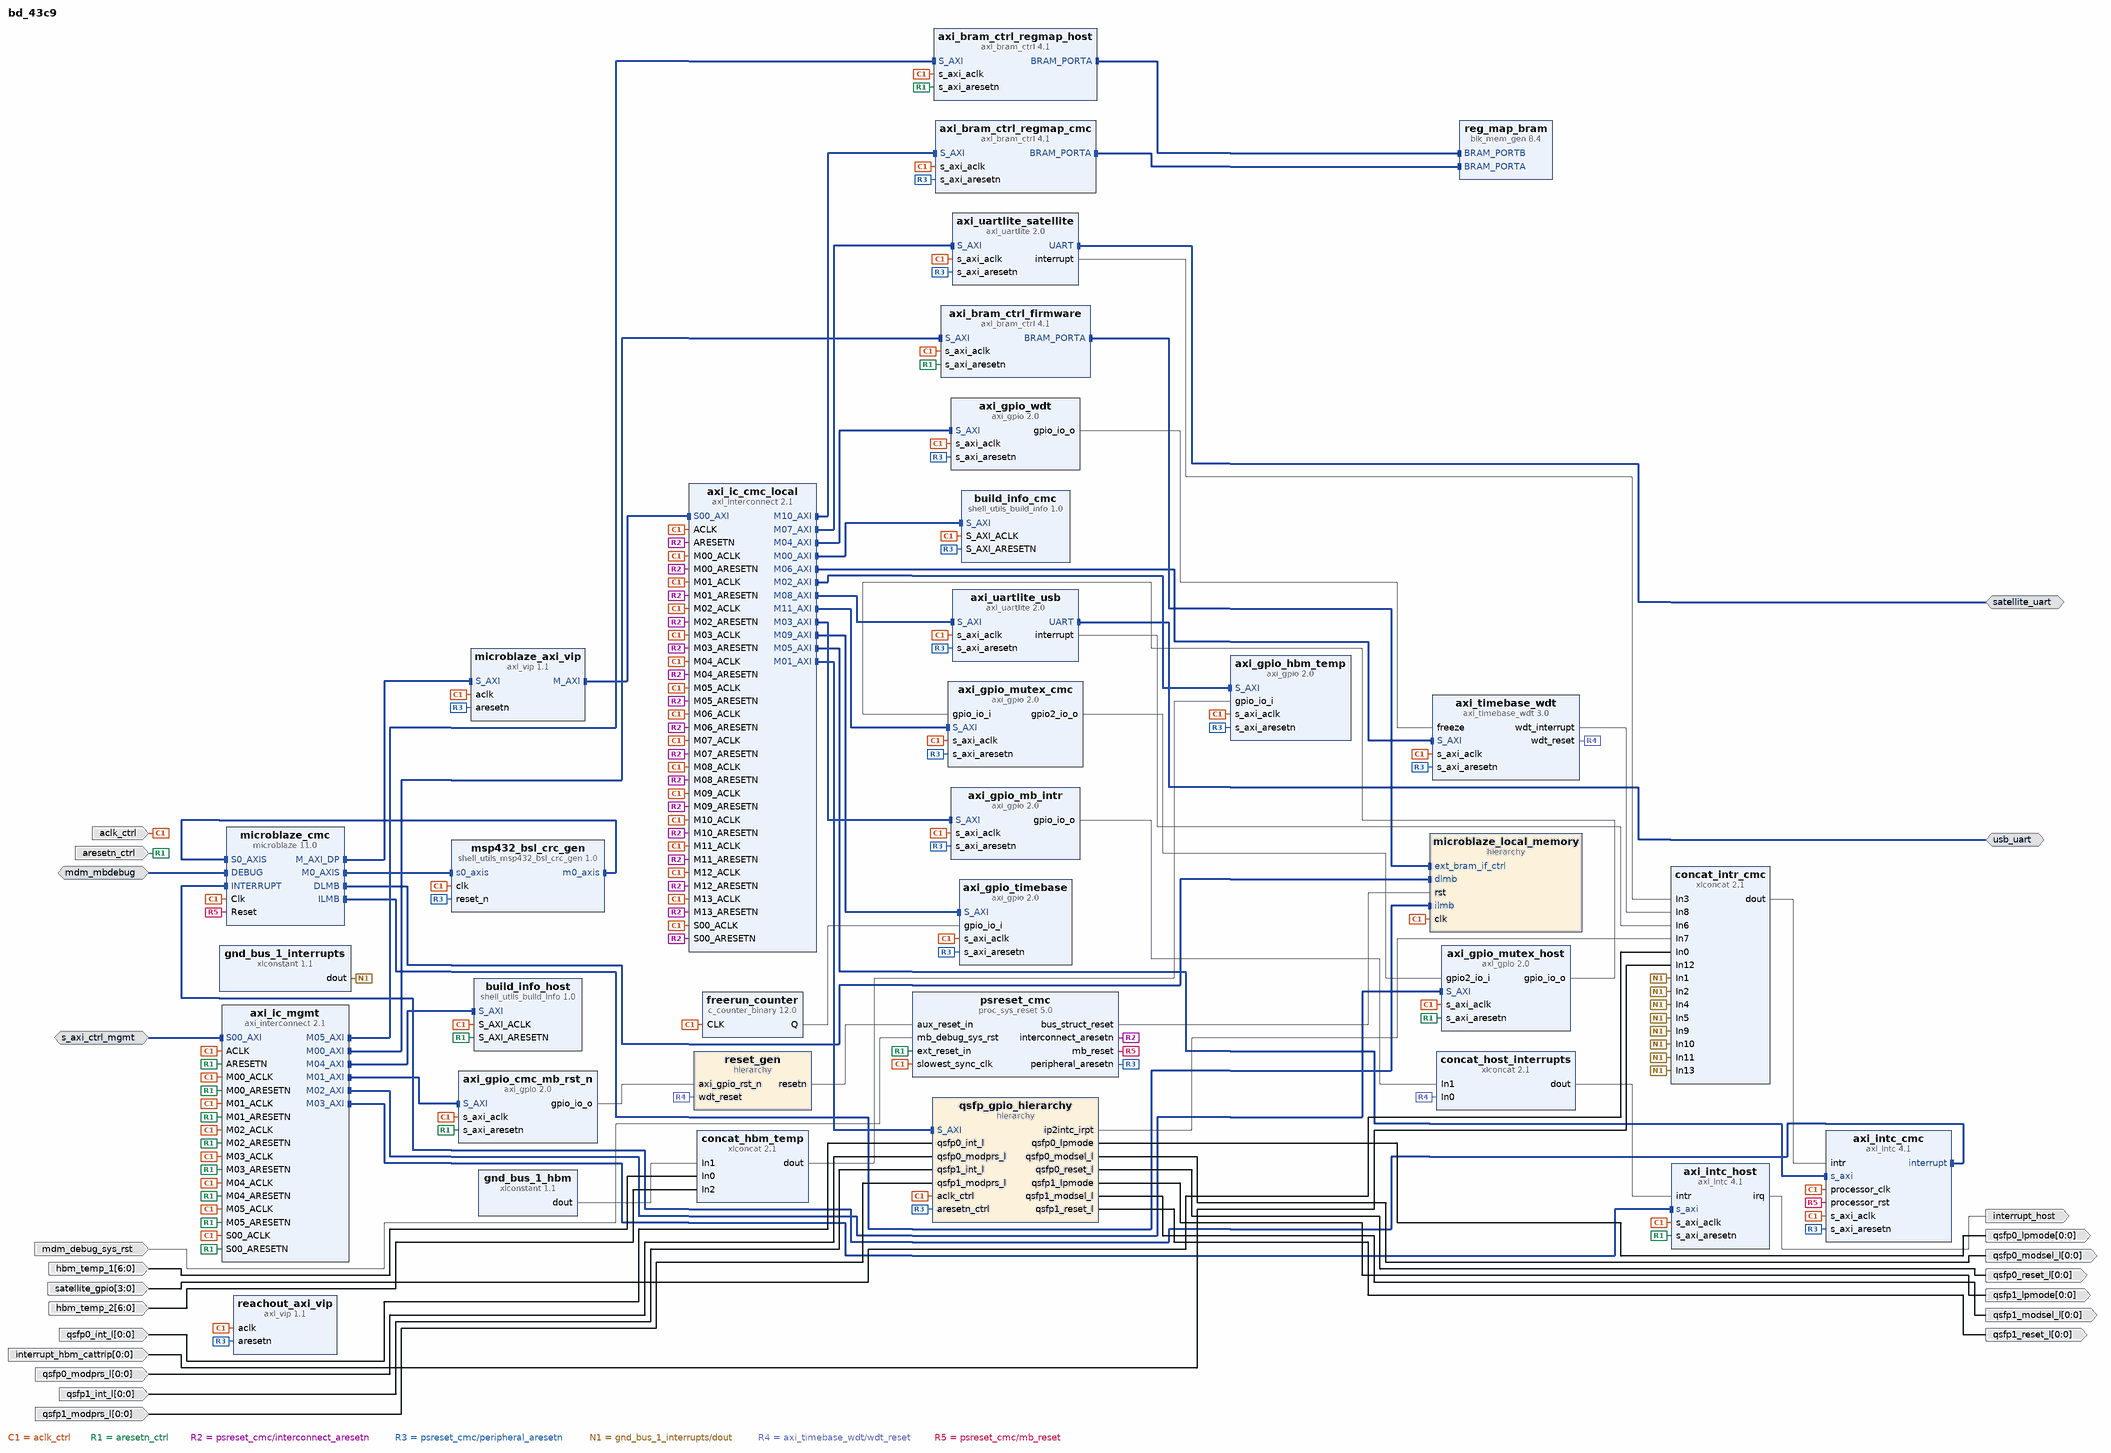
[diagram p0: block diagram of the top level]
# Vivado block design bd_43c9, xcu250-figd2104-2-e, Vivado 2020.2
create_bd_design bd_43c9

create_bd_intf_port -mode Slave -vlnv xilinx.com:interface:aximm_rtl:1.0 s_axi_ctrl_mgmt
set_property -dict [list \
  CONFIG.ADDR_WIDTH 18 \
  CONFIG.DATA_WIDTH 32 \
  CONFIG.HAS_BURST 0 \
  CONFIG.HAS_CACHE 0 \
  CONFIG.HAS_LOCK 0 \
  CONFIG.HAS_QOS 0 \
  CONFIG.INSERT_VIP 1 \
  CONFIG.MAX_BURST_LENGTH 1 \
  CONFIG.PROTOCOL AXI4LITE \
  CONFIG.SUPPORTS_NARROW_BURST 0 \
] [get_bd_intf_ports s_axi_ctrl_mgmt]
create_bd_intf_port -mode Slave -vlnv xilinx.com:interface:mbdebug_rtl:3.0 mdm_mbdebug
create_bd_intf_port -mode Master -vlnv xilinx.com:interface:uart_rtl:1.0 satellite_uart
create_bd_intf_port -mode Master -vlnv xilinx.com:interface:uart_rtl:1.0 usb_uart
create_bd_port -dir I -from 3 -to 0 -type intr satellite_gpio
set_property -dict {CONFIG.PortWidth 4 CONFIG.SENSITIVITY EDGE_RISING} [get_bd_ports satellite_gpio]
create_bd_port -dir I -type clk aclk_ctrl
set_property -dict [list \
  CONFIG.ASSOCIATED_BUSIF s_axi_ctrl_mgmt \
  CONFIG.ASSOCIATED_RESET aresetn_ctrl \
  CONFIG.INSERT_VIP 0 \
] [get_bd_ports aclk_ctrl]
create_bd_port -dir I -type rst aresetn_ctrl
set_property -dict {CONFIG.INSERT_VIP 0} [get_bd_ports aresetn_ctrl]
create_bd_port -dir I -type rst mdm_debug_sys_rst
set_property -dict {CONFIG.INSERT_VIP 0 CONFIG.POLARITY ACTIVE_HIGH} [get_bd_ports mdm_debug_sys_rst]
create_bd_port -dir I -from 0 -to 0 -type intr interrupt_hbm_cattrip
set_property -dict {CONFIG.PortWidth 1 CONFIG.SENSITIVITY LEVEL_HIGH} [get_bd_ports interrupt_hbm_cattrip]
create_bd_port -dir I -from 6 -to 0 hbm_temp_1
create_bd_port -dir I -from 6 -to 0 hbm_temp_2
create_bd_port -dir O -type intr interrupt_host
set_property -dict {CONFIG.SENSITIVITY LEVEL_HIGH} [get_bd_ports interrupt_host]
create_bd_port -dir I -from 0 -to 0 qsfp0_modprs_l
create_bd_port -dir I -from 0 -to 0 qsfp1_modprs_l
create_bd_port -dir I -from 0 -to 0 qsfp0_int_l
create_bd_port -dir I -from 0 -to 0 qsfp1_int_l
create_bd_port -dir O -from 0 -to 0 qsfp0_lpmode
create_bd_port -dir O -from 0 -to 0 qsfp1_lpmode
create_bd_port -dir O -from 0 -to 0 qsfp0_modsel_l
create_bd_port -dir O -from 0 -to 0 qsfp1_modsel_l
create_bd_port -dir O -from 0 -to 0 qsfp0_reset_l
create_bd_port -dir O -from 0 -to 0 qsfp1_reset_l

create_bd_cell -type ip -vlnv xilinx.com:ip:shell_utils_build_info:1.0 build_info_cmc
set_property -dict [list \
  CONFIG.C_CORE_REVISION 0 \
  CONFIG.C_MAJOR_VERSION 2 \
  CONFIG.C_MINOR_VERSION 2 \
  CONFIG.C_PATCH_REVISION 0 \
  CONFIG.C_PERFORCE_CL 3064653 \
  CONFIG.C_RESERVED_TAG 0x00000000 \
  CONFIG.C_SUBSYSTEM_ID 0x02 \
  CONFIG.C_VIV_VERSION 0x202010 \
] [get_bd_cells build_info_cmc]
create_bd_cell -type ip -vlnv xilinx.com:ip:shell_utils_build_info:1.0 build_info_host
set_property -dict [list \
  CONFIG.C_CORE_REVISION 0 \
  CONFIG.C_MAJOR_VERSION 2 \
  CONFIG.C_MINOR_VERSION 2 \
  CONFIG.C_PATCH_REVISION 0 \
  CONFIG.C_PERFORCE_CL 3064653 \
  CONFIG.C_RESERVED_TAG 0x00000000 \
  CONFIG.C_SUBSYSTEM_ID 0x02 \
  CONFIG.C_VIV_VERSION 0x202010 \
] [get_bd_cells build_info_host]
create_bd_cell -type ip -vlnv xilinx.com:ip:axi_gpio:2.0 axi_gpio_timebase
set_property -dict {CONFIG.C_ALL_INPUTS 1 CONFIG.C_GPIO_WIDTH 32} [get_bd_cells axi_gpio_timebase]
create_bd_cell -type ip -vlnv xilinx.com:ip:axi_gpio:2.0 axi_gpio_cmc_mb_rst_n
set_property -dict [list \
  CONFIG.C_ALL_OUTPUTS 1 \
  CONFIG.C_DOUT_DEFAULT 0x00000000 \
  CONFIG.C_GPIO_WIDTH 1 \
] [get_bd_cells axi_gpio_cmc_mb_rst_n]
create_bd_cell -type ip -vlnv xilinx.com:ip:axi_gpio:2.0 axi_gpio_hbm_temp
set_property -dict {CONFIG.C_ALL_INPUTS 1 CONFIG.C_GPIO_WIDTH 15} [get_bd_cells axi_gpio_hbm_temp]
create_bd_cell -type ip -vlnv xilinx.com:ip:axi_gpio:2.0 axi_gpio_wdt
set_property -dict {CONFIG.C_ALL_OUTPUTS 1 CONFIG.C_GPIO_WIDTH 1} [get_bd_cells axi_gpio_wdt]
create_bd_cell -type ip -vlnv xilinx.com:ip:axi_gpio:2.0 axi_gpio_mb_intr
set_property -dict {CONFIG.C_ALL_OUTPUTS 1 CONFIG.C_GPIO_WIDTH 31} [get_bd_cells axi_gpio_mb_intr]
create_bd_cell -type ip -vlnv xilinx.com:ip:axi_gpio:2.0 axi_gpio_mutex_cmc
set_property -dict [list \
  CONFIG.C_ALL_INPUTS 1 \
  CONFIG.C_ALL_INPUTS_2 0 \
  CONFIG.C_ALL_OUTPUTS_2 1 \
  CONFIG.C_GPIO2_WIDTH 2 \
  CONFIG.C_GPIO_WIDTH 1 \
  CONFIG.C_IS_DUAL 1 \
] [get_bd_cells axi_gpio_mutex_cmc]
create_bd_cell -type ip -vlnv xilinx.com:ip:axi_gpio:2.0 axi_gpio_mutex_host
set_property -dict [list \
  CONFIG.C_ALL_INPUTS_2 1 \
  CONFIG.C_ALL_OUTPUTS 1 \
  CONFIG.C_DOUT_DEFAULT 0x00000000 \
  CONFIG.C_GPIO2_WIDTH 2 \
  CONFIG.C_GPIO_WIDTH 1 \
  CONFIG.C_IS_DUAL 1 \
] [get_bd_cells axi_gpio_mutex_host]
create_bd_cell -type ip -vlnv xilinx.com:ip:axi_intc:4.1 axi_intc_cmc
set_property -dict [list \
  CONFIG.C_ASYNC_INTR 0x0000800F \
  CONFIG.C_ENABLE_ASYNC 0 \
  CONFIG.C_HAS_FAST 1 \
  CONFIG.C_KIND_OF_EDGE 0xFFFFFFFF \
  CONFIG.C_KIND_OF_INTR 0x0000024F \
  CONFIG.C_KIND_OF_LVL 0xFFFFFFFF \
  CONFIG.C_NUM_SW_INTR 15 \
] [get_bd_cells axi_intc_cmc]
create_bd_cell -type ip -vlnv xilinx.com:ip:axi_intc:4.1 axi_intc_host
set_property -dict [list \
  CONFIG.C_ASYNC_INTR 0x00000000 \
  CONFIG.C_ENABLE_ASYNC 0 \
  CONFIG.C_IRQ_CONNECTION 1 \
  CONFIG.C_KIND_OF_EDGE 0xFFFFFFFF \
  CONFIG.C_KIND_OF_INTR 0xFFFFFFFF \
  CONFIG.C_KIND_OF_LVL 0xFFFFFFFF \
  CONFIG.C_NUM_SW_INTR 0 \
] [get_bd_cells axi_intc_host]
create_bd_cell -type ip -vlnv xilinx.com:ip:axi_timebase_wdt:3.0 axi_timebase_wdt
set_property -dict {CONFIG.C_WDT_INTERVAL 31 CONFIG.WDT_ENABLE_ONCE Enable_repeatedly} [get_bd_cells axi_timebase_wdt]
create_bd_cell -type ip -vlnv xilinx.com:ip:axi_uartlite:2.0 axi_uartlite_satellite
set_property -dict {CONFIG.C_BAUDRATE 115200 CONFIG.C_USE_PARITY 1 CONFIG.PARITY Even} [get_bd_cells axi_uartlite_satellite]
create_bd_cell -type ip -vlnv xilinx.com:ip:axi_uartlite:2.0 axi_uartlite_usb
set_property -dict {CONFIG.C_BAUDRATE 115200} [get_bd_cells axi_uartlite_usb]
create_bd_cell -type ip -vlnv xilinx.com:ip:axi_interconnect:2.1 axi_ic_cmc_local
set_property -dict [list \
  CONFIG.M00_HAS_REGSLICE 0 \
  CONFIG.M01_HAS_REGSLICE 0 \
  CONFIG.M02_HAS_REGSLICE 0 \
  CONFIG.M03_HAS_REGSLICE 0 \
  CONFIG.M04_HAS_REGSLICE 0 \
  CONFIG.M05_HAS_REGSLICE 0 \
  CONFIG.M06_HAS_REGSLICE 0 \
  CONFIG.M07_HAS_REGSLICE 0 \
  CONFIG.M08_HAS_REGSLICE 0 \
  CONFIG.M09_HAS_REGSLICE 0 \
  CONFIG.M10_HAS_REGSLICE 0 \
  CONFIG.M11_HAS_REGSLICE 0 \
  CONFIG.M12_HAS_REGSLICE 0 \
  CONFIG.M13_HAS_REGSLICE 0 \
  CONFIG.NUM_MI 14 \
  CONFIG.S00_HAS_REGSLICE 0 \
] [get_bd_cells axi_ic_cmc_local]
create_bd_cell -type ip -vlnv xilinx.com:ip:axi_interconnect:2.1 axi_ic_mgmt
set_property -dict {CONFIG.NUM_MI 6} [get_bd_cells axi_ic_mgmt]
create_bd_cell -type ip -vlnv xilinx.com:ip:axi_bram_ctrl:4.1 axi_bram_ctrl_firmware
set_property -dict {CONFIG.PROTOCOL AXI4LITE CONFIG.SINGLE_PORT_BRAM 1} [get_bd_cells axi_bram_ctrl_firmware]
create_bd_cell -type hier microblaze_local_memory
create_bd_cell -type ip -vlnv xilinx.com:ip:microblaze:11.0 microblaze_cmc
set_property -dict [list \
  CONFIG.C_ASYNC_WAKEUP 3 \
  CONFIG.C_BASE_VECTORS 0x00000000F0000000 \
  CONFIG.C_D_AXI 1 \
  CONFIG.C_ENABLE_DISCRETE_PORTS 0 \
  CONFIG.C_FSL_LINKS 1 \
  CONFIG.C_M_AXI_DC_USER_SIGNALS 0 \
  CONFIG.C_M_AXI_IC_USER_SIGNALS 0 \
  CONFIG.C_USE_BARREL 1 \
  CONFIG.C_USE_DIV 1 \
  CONFIG.C_USE_EXT_BRK 0 \
  CONFIG.C_USE_EXT_NM_BRK 0 \
  CONFIG.C_USE_HW_MUL 2 \
  CONFIG.C_USE_INTERRUPT 2 \
  CONFIG.C_USE_MSR_INSTR 1 \
  CONFIG.C_USE_NON_SECURE 0 \
  CONFIG.C_USE_PCMP_INSTR 1 \
] [get_bd_cells microblaze_cmc]
create_bd_cell -type ip -vlnv xilinx.com:ip:axi_vip:1.1 microblaze_axi_vip
create_bd_cell -type ip -vlnv xilinx.com:ip:axi_vip:1.1 reachout_axi_vip
create_bd_cell -type ip -vlnv xilinx.com:ip:shell_utils_msp432_bsl_crc_gen:1.0 msp432_bsl_crc_gen
create_bd_cell -type ip -vlnv xilinx.com:ip:proc_sys_reset:5.0 psreset_cmc
set_property -dict {CONFIG.C_AUX_RST_WIDTH 1 CONFIG.C_EXT_RST_WIDTH 1} [get_bd_cells psreset_cmc]
create_bd_cell -type ip -vlnv xilinx.com:ip:blk_mem_gen:8.4 reg_map_bram
set_property -dict [list \
  CONFIG.Assume_Synchronous_Clk true \
  CONFIG.Enable_B Use_ENB_Pin \
  CONFIG.Memory_Type True_Dual_Port_RAM \
  CONFIG.Use_RSTB_Pin true \
] [get_bd_cells reg_map_bram]
create_bd_cell -type ip -vlnv xilinx.com:ip:axi_bram_ctrl:4.1 axi_bram_ctrl_regmap_cmc
set_property -dict {CONFIG.PROTOCOL AXI4LITE CONFIG.SINGLE_PORT_BRAM 1} [get_bd_cells axi_bram_ctrl_regmap_cmc]
create_bd_cell -type ip -vlnv xilinx.com:ip:axi_bram_ctrl:4.1 axi_bram_ctrl_regmap_host
set_property -dict {CONFIG.PROTOCOL AXI4LITE CONFIG.SINGLE_PORT_BRAM 1} [get_bd_cells axi_bram_ctrl_regmap_host]
create_bd_cell -type ip -vlnv xilinx.com:ip:xlconcat:2.1 concat_intr_cmc
set_property -dict {CONFIG.IN0_WIDTH 4 CONFIG.NUM_PORTS 14} [get_bd_cells concat_intr_cmc]
create_bd_cell -type ip -vlnv xilinx.com:ip:xlconcat:2.1 concat_hbm_temp
set_property -dict {CONFIG.IN0_WIDTH 7 CONFIG.IN2_WIDTH 7 CONFIG.NUM_PORTS 3} [get_bd_cells concat_hbm_temp]
create_bd_cell -type ip -vlnv xilinx.com:ip:xlconcat:2.1 concat_host_interrupts
set_property -dict {CONFIG.IN1_WIDTH 31 CONFIG.NUM_PORTS 2} [get_bd_cells concat_host_interrupts]
create_bd_cell -type ip -vlnv xilinx.com:ip:xlconstant:1.1 gnd_bus_1_hbm
set_property -dict {CONFIG.CONST_VAL 0 CONFIG.CONST_WIDTH 1} [get_bd_cells gnd_bus_1_hbm]
create_bd_cell -type ip -vlnv xilinx.com:ip:xlconstant:1.1 gnd_bus_1_interrupts
set_property -dict {CONFIG.CONST_VAL 0 CONFIG.CONST_WIDTH 1} [get_bd_cells gnd_bus_1_interrupts]
create_bd_cell -type ip -vlnv xilinx.com:ip:c_counter_binary:12.0 freerun_counter
set_property -dict {CONFIG.Output_Width 32} [get_bd_cells freerun_counter]
create_bd_cell -type hier qsfp_gpio_hierarchy
create_bd_cell -type hier reset_gen

# ---- hierarchy /microblaze_local_memory ----
current_bd_instance /microblaze_local_memory
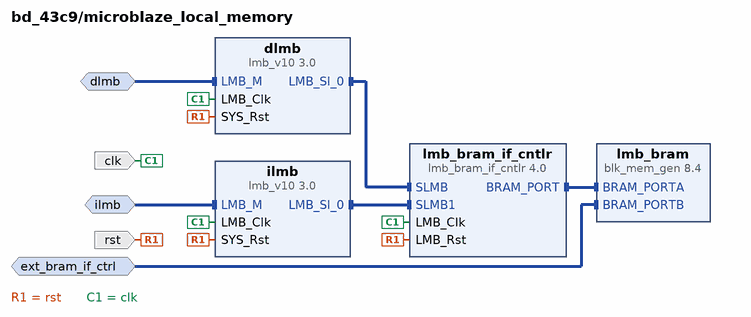
[diagram p1: block diagram inside /microblaze_local_memory]
create_bd_intf_pin -mode MirroredMaster -vlnv xilinx.com:interface:lmb_rtl:1.0 dlmb
create_bd_intf_pin -mode MirroredMaster -vlnv xilinx.com:interface:lmb_rtl:1.0 ilmb
create_bd_intf_pin -mode Slave -vlnv xilinx.com:interface:bram_rtl:1.0 ext_bram_if_ctrl
create_bd_pin -dir I -type clk clk
create_bd_pin -dir I -type rst rst

create_bd_cell -type ip -vlnv xilinx.com:ip:lmb_v10:3.0 dlmb
create_bd_cell -type ip -vlnv xilinx.com:ip:lmb_v10:3.0 ilmb
create_bd_cell -type ip -vlnv xilinx.com:ip:blk_mem_gen:8.4 lmb_bram
set_property -dict {CONFIG.Memory_Type True_Dual_Port_RAM CONFIG.PRIM_type_to_Implement BRAM} [get_bd_cells lmb_bram]
create_bd_cell -type ip -vlnv xilinx.com:ip:lmb_bram_if_cntlr:4.0 lmb_bram_if_cntlr
set_property -dict {CONFIG.C_NUM_LMB 2} [get_bd_cells lmb_bram_if_cntlr]

# ---- hierarchy /qsfp_gpio_hierarchy ----
current_bd_instance /qsfp_gpio_hierarchy
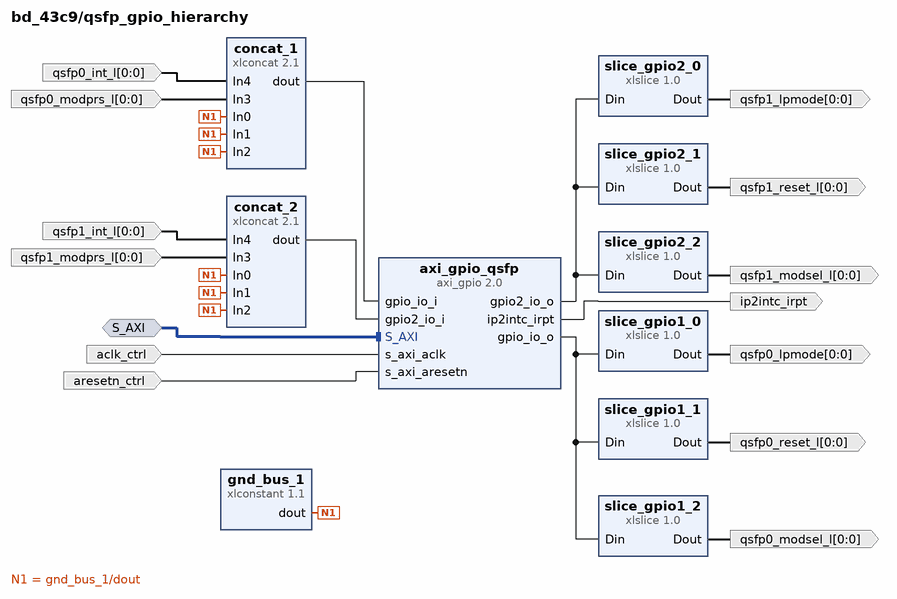
[diagram p2: block diagram inside /qsfp_gpio_hierarchy]
create_bd_intf_pin -mode Slave -vlnv xilinx.com:interface:aximm_rtl:1.0 S_AXI
create_bd_pin -dir I -type clk aclk_ctrl
create_bd_pin -dir O -type intr ip2intc_irpt
create_bd_pin -dir I -from 0 -to 0 qsfp0_int_l
create_bd_pin -dir O -from 0 -to 0 qsfp0_lpmode
create_bd_pin -dir I -from 0 -to 0 qsfp0_modprs_l
create_bd_pin -dir O -from 0 -to 0 qsfp0_modsel_l
create_bd_pin -dir O -from 0 -to 0 qsfp0_reset_l
create_bd_pin -dir I -from 0 -to 0 qsfp1_int_l
create_bd_pin -dir O -from 0 -to 0 qsfp1_lpmode
create_bd_pin -dir I -from 0 -to 0 qsfp1_modprs_l
create_bd_pin -dir O -from 0 -to 0 qsfp1_modsel_l
create_bd_pin -dir O -from 0 -to 0 qsfp1_reset_l
create_bd_pin -dir I -type rst aresetn_ctrl

create_bd_cell -type ip -vlnv xilinx.com:ip:axi_gpio:2.0 axi_gpio_qsfp
set_property -dict [list \
  CONFIG.C_ALL_OUTPUTS_2 0 \
  CONFIG.C_DOUT_DEFAULT 0x00000002 \
  CONFIG.C_DOUT_DEFAULT_2 0x00000002 \
  CONFIG.C_GPIO2_WIDTH 5 \
  CONFIG.C_GPIO_WIDTH 5 \
  CONFIG.C_INTERRUPT_PRESENT 1 \
  CONFIG.C_IS_DUAL 1 \
  CONFIG.C_TRI_DEFAULT 0xFFFFFFF8 \
  CONFIG.C_TRI_DEFAULT_2 0xFFFFFFF8 \
] [get_bd_cells axi_gpio_qsfp]
create_bd_cell -type ip -vlnv xilinx.com:ip:xlconcat:2.1 concat_1
set_property -dict {CONFIG.NUM_PORTS 5} [get_bd_cells concat_1]
create_bd_cell -type ip -vlnv xilinx.com:ip:xlconcat:2.1 concat_2
set_property -dict {CONFIG.NUM_PORTS 5} [get_bd_cells concat_2]
create_bd_cell -type ip -vlnv xilinx.com:ip:xlconstant:1.1 gnd_bus_1
set_property -dict {CONFIG.CONST_VAL 0} [get_bd_cells gnd_bus_1]
create_bd_cell -type ip -vlnv xilinx.com:ip:xlslice:1.0 slice_gpio1_0
set_property -dict {CONFIG.DIN_FROM 0 CONFIG.DIN_TO 0 CONFIG.DIN_WIDTH 5} [get_bd_cells slice_gpio1_0]
create_bd_cell -type ip -vlnv xilinx.com:ip:xlslice:1.0 slice_gpio1_1
set_property -dict {CONFIG.DIN_FROM 1 CONFIG.DIN_TO 1 CONFIG.DIN_WIDTH 5 CONFIG.DOUT_WIDTH 1} [get_bd_cells slice_gpio1_1]
create_bd_cell -type ip -vlnv xilinx.com:ip:xlslice:1.0 slice_gpio1_2
set_property -dict {CONFIG.DIN_FROM 2 CONFIG.DIN_TO 2 CONFIG.DIN_WIDTH 5 CONFIG.DOUT_WIDTH 1} [get_bd_cells slice_gpio1_2]
create_bd_cell -type ip -vlnv xilinx.com:ip:xlslice:1.0 slice_gpio2_0
set_property -dict {CONFIG.DIN_FROM 0 CONFIG.DIN_TO 0 CONFIG.DIN_WIDTH 5} [get_bd_cells slice_gpio2_0]
create_bd_cell -type ip -vlnv xilinx.com:ip:xlslice:1.0 slice_gpio2_1
set_property -dict {CONFIG.DIN_FROM 1 CONFIG.DIN_TO 1 CONFIG.DIN_WIDTH 5 CONFIG.DOUT_WIDTH 1} [get_bd_cells slice_gpio2_1]
create_bd_cell -type ip -vlnv xilinx.com:ip:xlslice:1.0 slice_gpio2_2
set_property -dict {CONFIG.DIN_FROM 2 CONFIG.DIN_TO 2 CONFIG.DIN_WIDTH 5 CONFIG.DOUT_WIDTH 1} [get_bd_cells slice_gpio2_2]

# ---- hierarchy /reset_gen ----
current_bd_instance /reset_gen
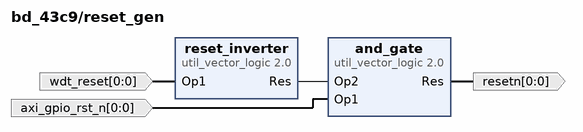
[diagram p3: block diagram inside /reset_gen]
create_bd_pin -dir I -from 0 -to 0 axi_gpio_rst_n
create_bd_pin -dir I -from 0 -to 0 wdt_reset
create_bd_pin -dir O -from 0 -to 0 resetn

create_bd_cell -type ip -vlnv xilinx.com:ip:util_vector_logic:2.0 and_gate
set_property -dict {CONFIG.C_OPERATION and CONFIG.C_SIZE 1} [get_bd_cells and_gate]
create_bd_cell -type ip -vlnv xilinx.com:ip:util_vector_logic:2.0 reset_inverter
set_property -dict {CONFIG.C_OPERATION not CONFIG.C_SIZE 1} [get_bd_cells reset_inverter]

# ---- connections ----

current_bd_instance /microblaze_local_memory
connect_bd_intf_net [get_bd_intf_pins dlmb] [get_bd_intf_pins dlmb/LMB_M]
connect_bd_intf_net [get_bd_intf_pins ilmb] [get_bd_intf_pins ilmb/LMB_M]
connect_bd_intf_net -intf_net dlmb_s [get_bd_intf_pins dlmb/LMB_Sl_0] [get_bd_intf_pins lmb_bram_if_cntlr/SLMB]
connect_bd_intf_net -intf_net ilmb_s [get_bd_intf_pins ilmb/LMB_Sl_0] [get_bd_intf_pins lmb_bram_if_cntlr/SLMB1]
connect_bd_intf_net -intf_net lmb_bram_if_ctrl [get_bd_intf_pins lmb_bram/BRAM_PORTA] [get_bd_intf_pins lmb_bram_if_cntlr/BRAM_PORT]
connect_bd_intf_net [get_bd_intf_pins ext_bram_if_ctrl] [get_bd_intf_pins lmb_bram/BRAM_PORTB]
connect_bd_net [get_bd_pins rst] [get_bd_pins dlmb/SYS_Rst] [get_bd_pins ilmb/SYS_Rst] [get_bd_pins lmb_bram_if_cntlr/LMB_Rst]
connect_bd_net [get_bd_pins clk] [get_bd_pins dlmb/LMB_Clk] [get_bd_pins ilmb/LMB_Clk] [get_bd_pins lmb_bram_if_cntlr/LMB_Clk]
set_property HDL_ATTRIBUTE.BMM_INFO_ADDRESS_SPACE {byte  0xF0000000 32 > bd_43c9 microblaze_local_memory/lmb_bram} [get_bd_cells lmb_bram_if_cntlr]
set_property HDL_ATTRIBUTE.KEEP_HIERARCHY yes [get_bd_cells lmb_bram_if_cntlr]

current_bd_instance /qsfp_gpio_hierarchy
connect_bd_intf_net -intf_net axi_int_cmc_2_M03 [get_bd_intf_pins S_AXI] [get_bd_intf_pins axi_gpio_qsfp/S_AXI]
connect_bd_net -net axi_gpio_qsfp_in_1 [get_bd_pins concat_1/dout] [get_bd_pins axi_gpio_qsfp/gpio_io_i]
connect_bd_net -net axi_gpio_qsfp_in_2 [get_bd_pins concat_2/dout] [get_bd_pins axi_gpio_qsfp/gpio2_io_i]
connect_bd_net -net axi_gpio_qsfp_out_1 [get_bd_pins axi_gpio_qsfp/gpio_io_o] \
  [get_bd_pins slice_gpio1_0/Din] [get_bd_pins slice_gpio1_1/Din] [get_bd_pins slice_gpio1_2/Din]
connect_bd_net -net axi_gpio_qsfp_out_2 [get_bd_pins axi_gpio_qsfp/gpio2_io_o] \
  [get_bd_pins slice_gpio2_0/Din] [get_bd_pins slice_gpio2_1/Din] [get_bd_pins slice_gpio2_2/Din]
connect_bd_net [get_bd_pins aclk_ctrl] [get_bd_pins axi_gpio_qsfp/s_axi_aclk]
connect_bd_net -net cmc_perip_aresetn [get_bd_pins aresetn_ctrl] [get_bd_pins axi_gpio_qsfp/s_axi_aresetn]
connect_bd_net -net intr_gpio_qsfp [get_bd_pins axi_gpio_qsfp/ip2intc_irpt] [get_bd_pins ip2intc_irpt]
connect_bd_net [get_bd_pins qsfp0_int_l] [get_bd_pins concat_1/In4]
connect_bd_net -net qsfp0_lpmode [get_bd_pins slice_gpio1_0/Dout] [get_bd_pins qsfp0_lpmode]
connect_bd_net [get_bd_pins qsfp0_modprs_l] [get_bd_pins concat_1/In3]
connect_bd_net -net qsfp0_modsel_l [get_bd_pins slice_gpio1_2/Dout] [get_bd_pins qsfp0_modsel_l]
connect_bd_net -net qsfp0_reset_l [get_bd_pins slice_gpio1_1/Dout] [get_bd_pins qsfp0_reset_l]
connect_bd_net [get_bd_pins qsfp1_int_l] [get_bd_pins concat_2/In4]
connect_bd_net -net qsfp1_lpmode [get_bd_pins slice_gpio2_0/Dout] [get_bd_pins qsfp1_lpmode]
connect_bd_net [get_bd_pins qsfp1_modprs_l] [get_bd_pins concat_2/In3]
connect_bd_net -net qsfp1_modsel_l [get_bd_pins slice_gpio2_2/Dout] [get_bd_pins qsfp1_modsel_l]
connect_bd_net -net qsfp1_reset_l [get_bd_pins slice_gpio2_1/Dout] [get_bd_pins qsfp1_reset_l]
connect_bd_net -net gnd_bus_1 [get_bd_pins gnd_bus_1/dout] \
  [get_bd_pins concat_1/In0] [get_bd_pins concat_1/In1] [get_bd_pins concat_1/In2] [get_bd_pins concat_2/In0] \
  [get_bd_pins concat_2/In1] [get_bd_pins concat_2/In2]

current_bd_instance /reset_gen
connect_bd_net -net wdt_reset_net [get_bd_pins wdt_reset] [get_bd_pins reset_inverter/Op1]
connect_bd_net -net axi_gpio_rst_n_net [get_bd_pins axi_gpio_rst_n] [get_bd_pins and_gate/Op1]
connect_bd_net -net reset_inverter_net [get_bd_pins reset_inverter/Res] [get_bd_pins and_gate/Op2]
connect_bd_net -net resetn_net [get_bd_pins and_gate/Res] [get_bd_pins resetn]

current_bd_instance /
connect_bd_intf_net [get_bd_intf_pins build_info_host/S_AXI] [get_bd_intf_pins axi_ic_mgmt/M04_AXI]
connect_bd_intf_net -intf_net axi_bram_ctrl_reg_map1_BRAM_PORTA [get_bd_intf_pins axi_bram_ctrl_regmap_host/BRAM_PORTA] [get_bd_intf_pins reg_map_bram/BRAM_PORTB]
connect_bd_intf_net [get_bd_intf_pins axi_bram_ctrl_regmap_host/S_AXI] [get_bd_intf_pins axi_ic_mgmt/M05_AXI]
connect_bd_intf_net -intf_net axi_bram_ctrl_lmb_BRAM_PORTA [get_bd_intf_pins axi_bram_ctrl_firmware/BRAM_PORTA] [get_bd_intf_pins microblaze_local_memory/ext_bram_if_ctrl]
connect_bd_intf_net [get_bd_intf_pins axi_intc_cmc/interrupt] [get_bd_intf_pins microblaze_cmc/INTERRUPT]
connect_bd_intf_net [get_bd_intf_ports mdm_mbdebug] [get_bd_intf_pins microblaze_cmc/DEBUG]
connect_bd_intf_net [get_bd_intf_pins microblaze_cmc/DLMB] [get_bd_intf_pins microblaze_local_memory/dlmb]
connect_bd_intf_net [get_bd_intf_pins microblaze_cmc/ILMB] [get_bd_intf_pins microblaze_local_memory/ilmb]
connect_bd_intf_net [get_bd_intf_pins microblaze_cmc/M0_AXIS] [get_bd_intf_pins msp432_bsl_crc_gen/s0_axis]
connect_bd_intf_net [get_bd_intf_pins microblaze_cmc/S0_AXIS] [get_bd_intf_pins msp432_bsl_crc_gen/m0_axis]
connect_bd_intf_net -intf_net reg_map_bram_ctrl [get_bd_intf_pins axi_bram_ctrl_regmap_cmc/BRAM_PORTA] [get_bd_intf_pins reg_map_bram/BRAM_PORTA]
connect_bd_intf_net [get_bd_intf_ports satellite_uart] [get_bd_intf_pins axi_uartlite_satellite/UART]
connect_bd_intf_net -intf_net s_axi_ctrl_mgmt_net [get_bd_intf_ports s_axi_ctrl_mgmt] [get_bd_intf_pins axi_ic_mgmt/S00_AXI]
connect_bd_intf_net [get_bd_intf_pins axi_bram_ctrl_firmware/S_AXI] [get_bd_intf_pins axi_ic_mgmt/M00_AXI]
connect_bd_intf_net [get_bd_intf_pins axi_gpio_cmc_mb_rst_n/S_AXI] [get_bd_intf_pins axi_ic_mgmt/M01_AXI]
connect_bd_intf_net [get_bd_intf_pins axi_gpio_mutex_host/S_AXI] [get_bd_intf_pins axi_ic_mgmt/M02_AXI]
connect_bd_intf_net [get_bd_intf_pins axi_intc_host/s_axi] [get_bd_intf_pins axi_ic_mgmt/M03_AXI]
connect_bd_intf_net [get_bd_intf_pins microblaze_cmc/M_AXI_DP] [get_bd_intf_pins microblaze_axi_vip/S_AXI]
connect_bd_intf_net [get_bd_intf_pins microblaze_axi_vip/M_AXI] [get_bd_intf_pins axi_ic_cmc_local/S00_AXI]
connect_bd_intf_net [get_bd_intf_pins axi_ic_cmc_local/M00_AXI] [get_bd_intf_pins build_info_cmc/S_AXI]
connect_bd_intf_net [get_bd_intf_pins axi_ic_cmc_local/M01_AXI] [get_bd_intf_pins qsfp_gpio_hierarchy/S_AXI]
connect_bd_intf_net [get_bd_intf_pins axi_ic_cmc_local/M02_AXI] [get_bd_intf_pins axi_gpio_hbm_temp/S_AXI]
connect_bd_intf_net [get_bd_intf_pins axi_ic_cmc_local/M03_AXI] [get_bd_intf_pins axi_gpio_mb_intr/S_AXI]
connect_bd_intf_net [get_bd_intf_pins axi_ic_cmc_local/M04_AXI] [get_bd_intf_pins axi_gpio_wdt/S_AXI]
connect_bd_intf_net [get_bd_intf_pins axi_ic_cmc_local/M05_AXI] [get_bd_intf_pins axi_intc_cmc/s_axi]
connect_bd_intf_net [get_bd_intf_pins axi_ic_cmc_local/M06_AXI] [get_bd_intf_pins axi_timebase_wdt/S_AXI]
connect_bd_intf_net [get_bd_intf_pins axi_ic_cmc_local/M07_AXI] [get_bd_intf_pins axi_uartlite_satellite/S_AXI]
connect_bd_intf_net [get_bd_intf_pins axi_ic_cmc_local/M08_AXI] [get_bd_intf_pins axi_uartlite_usb/S_AXI]
connect_bd_intf_net [get_bd_intf_pins axi_ic_cmc_local/M09_AXI] [get_bd_intf_pins axi_gpio_timebase/S_AXI]
connect_bd_intf_net [get_bd_intf_pins axi_ic_cmc_local/M10_AXI] [get_bd_intf_pins axi_bram_ctrl_regmap_cmc/S_AXI]
connect_bd_intf_net [get_bd_intf_pins axi_ic_cmc_local/M11_AXI] [get_bd_intf_pins axi_gpio_mutex_cmc/S_AXI]
connect_bd_intf_net [get_bd_intf_ports usb_uart] [get_bd_intf_pins axi_uartlite_usb/UART]
connect_bd_net -net aclk_ctrl_net [get_bd_ports aclk_ctrl] \
  [get_bd_pins axi_bram_ctrl_firmware/s_axi_aclk] [get_bd_pins axi_bram_ctrl_regmap_cmc/s_axi_aclk] \
  [get_bd_pins axi_bram_ctrl_regmap_host/s_axi_aclk] [get_bd_pins axi_gpio_cmc_mb_rst_n/s_axi_aclk] \
  [get_bd_pins axi_gpio_hbm_temp/s_axi_aclk] [get_bd_pins axi_gpio_mb_intr/s_axi_aclk] \
  [get_bd_pins axi_gpio_mutex_cmc/s_axi_aclk] [get_bd_pins axi_gpio_mutex_host/s_axi_aclk] \
  [get_bd_pins axi_gpio_timebase/s_axi_aclk] [get_bd_pins axi_gpio_wdt/s_axi_aclk] [get_bd_pins axi_ic_cmc_local/ACLK] \
  [get_bd_pins axi_ic_cmc_local/M00_ACLK] [get_bd_pins axi_ic_cmc_local/M01_ACLK] [get_bd_pins axi_ic_cmc_local/M02_ACLK] \
  [get_bd_pins axi_ic_cmc_local/M03_ACLK] [get_bd_pins axi_ic_cmc_local/M04_ACLK] [get_bd_pins axi_ic_cmc_local/M05_ACLK] \
  [get_bd_pins axi_ic_cmc_local/M06_ACLK] [get_bd_pins axi_ic_cmc_local/M07_ACLK] [get_bd_pins axi_ic_cmc_local/M08_ACLK] \
  [get_bd_pins axi_ic_cmc_local/M09_ACLK] [get_bd_pins axi_ic_cmc_local/M10_ACLK] [get_bd_pins axi_ic_cmc_local/M11_ACLK] \
  [get_bd_pins axi_ic_cmc_local/M12_ACLK] [get_bd_pins axi_ic_cmc_local/M13_ACLK] [get_bd_pins axi_ic_cmc_local/S00_ACLK] \
  [get_bd_pins axi_ic_mgmt/ACLK] [get_bd_pins axi_ic_mgmt/M00_ACLK] [get_bd_pins axi_ic_mgmt/M01_ACLK] \
  [get_bd_pins axi_ic_mgmt/M02_ACLK] [get_bd_pins axi_ic_mgmt/M03_ACLK] [get_bd_pins axi_ic_mgmt/M04_ACLK] \
  [get_bd_pins axi_ic_mgmt/M05_ACLK] [get_bd_pins axi_ic_mgmt/S00_ACLK] [get_bd_pins axi_intc_cmc/processor_clk] \
  [get_bd_pins axi_intc_cmc/s_axi_aclk] [get_bd_pins axi_intc_host/s_axi_aclk] [get_bd_pins axi_timebase_wdt/s_axi_aclk] \
  [get_bd_pins axi_uartlite_satellite/s_axi_aclk] [get_bd_pins axi_uartlite_usb/s_axi_aclk] \
  [get_bd_pins build_info_cmc/S_AXI_ACLK] [get_bd_pins build_info_host/S_AXI_ACLK] [get_bd_pins freerun_counter/CLK] \
  [get_bd_pins microblaze_axi_vip/aclk] [get_bd_pins microblaze_cmc/Clk] [get_bd_pins microblaze_local_memory/clk] \
  [get_bd_pins msp432_bsl_crc_gen/clk] [get_bd_pins psreset_cmc/slowest_sync_clk] [get_bd_pins qsfp_gpio_hierarchy/aclk_ctrl] \
  [get_bd_pins reachout_axi_vip/aclk]
connect_bd_net -net aresetn_ctrl_net [get_bd_ports aresetn_ctrl] \
  [get_bd_pins axi_bram_ctrl_firmware/s_axi_aresetn] [get_bd_pins axi_bram_ctrl_regmap_host/s_axi_aresetn] \
  [get_bd_pins axi_gpio_cmc_mb_rst_n/s_axi_aresetn] [get_bd_pins axi_intc_host/s_axi_aresetn] \
  [get_bd_pins axi_gpio_mutex_host/s_axi_aresetn] [get_bd_pins build_info_host/S_AXI_ARESETN] \
  [get_bd_pins axi_ic_mgmt/ARESETN] [get_bd_pins axi_ic_mgmt/M00_ARESETN] [get_bd_pins axi_ic_mgmt/M01_ARESETN] \
  [get_bd_pins axi_ic_mgmt/M02_ARESETN] [get_bd_pins axi_ic_mgmt/M03_ARESETN] [get_bd_pins axi_ic_mgmt/M04_ARESETN] \
  [get_bd_pins axi_ic_mgmt/M05_ARESETN] [get_bd_pins axi_ic_mgmt/S00_ARESETN] [get_bd_pins psreset_cmc/ext_reset_in]
connect_bd_net [get_bd_pins psreset_cmc/interconnect_aresetn] \
  [get_bd_pins axi_ic_cmc_local/ARESETN] [get_bd_pins axi_ic_cmc_local/M00_ARESETN] \
  [get_bd_pins axi_ic_cmc_local/M01_ARESETN] [get_bd_pins axi_ic_cmc_local/M02_ARESETN] \
  [get_bd_pins axi_ic_cmc_local/M03_ARESETN] [get_bd_pins axi_ic_cmc_local/M04_ARESETN] \
  [get_bd_pins axi_ic_cmc_local/M05_ARESETN] [get_bd_pins axi_ic_cmc_local/M06_ARESETN] \
  [get_bd_pins axi_ic_cmc_local/M07_ARESETN] [get_bd_pins axi_ic_cmc_local/M08_ARESETN] \
  [get_bd_pins axi_ic_cmc_local/M09_ARESETN] [get_bd_pins axi_ic_cmc_local/M10_ARESETN] \
  [get_bd_pins axi_ic_cmc_local/M11_ARESETN] [get_bd_pins axi_ic_cmc_local/M12_ARESETN] \
  [get_bd_pins axi_ic_cmc_local/M13_ARESETN] [get_bd_pins axi_ic_cmc_local/S00_ARESETN]
connect_bd_net [get_bd_pins psreset_cmc/peripheral_aresetn] \
  [get_bd_pins axi_bram_ctrl_regmap_cmc/s_axi_aresetn] [get_bd_pins axi_gpio_hbm_temp/s_axi_aresetn] \
  [get_bd_pins axi_gpio_mb_intr/s_axi_aresetn] [get_bd_pins axi_gpio_mutex_cmc/s_axi_aresetn] \
  [get_bd_pins axi_gpio_timebase/s_axi_aresetn] [get_bd_pins axi_gpio_wdt/s_axi_aresetn] \
  [get_bd_pins build_info_cmc/S_AXI_ARESETN] [get_bd_pins axi_intc_cmc/s_axi_aresetn] \
  [get_bd_pins axi_timebase_wdt/s_axi_aresetn] [get_bd_pins axi_uartlite_satellite/s_axi_aresetn] \
  [get_bd_pins msp432_bsl_crc_gen/reset_n] [get_bd_pins microblaze_axi_vip/aresetn] [get_bd_pins reachout_axi_vip/aresetn] \
  [get_bd_pins axi_uartlite_usb/s_axi_aresetn] [get_bd_pins qsfp_gpio_hierarchy/aresetn_ctrl]
connect_bd_net -net sc_gpio_interrupts [get_bd_ports satellite_gpio] [get_bd_pins concat_intr_cmc/In0]
connect_bd_net -net gnd_bus_1_interrupt_dout [get_bd_pins gnd_bus_1_interrupts/dout] \
  [get_bd_pins concat_intr_cmc/In1] [get_bd_pins concat_intr_cmc/In2] [get_bd_pins concat_intr_cmc/In4] \
  [get_bd_pins concat_intr_cmc/In5] [get_bd_pins concat_intr_cmc/In9] [get_bd_pins concat_intr_cmc/In10] \
  [get_bd_pins concat_intr_cmc/In11] [get_bd_pins concat_intr_cmc/In13]
connect_bd_net [get_bd_pins axi_uartlite_satellite/interrupt] [get_bd_pins concat_intr_cmc/In3]
connect_bd_net [get_bd_pins axi_uartlite_usb/interrupt] [get_bd_pins concat_intr_cmc/In6]
connect_bd_net -net intr_gpio_qsfp [get_bd_pins qsfp_gpio_hierarchy/ip2intc_irpt] [get_bd_pins concat_intr_cmc/In7]
connect_bd_net [get_bd_pins axi_timebase_wdt/wdt_interrupt] [get_bd_pins concat_intr_cmc/In8]
connect_bd_net [get_bd_ports interrupt_hbm_cattrip] [get_bd_pins concat_intr_cmc/In12]
connect_bd_net [get_bd_pins concat_intr_cmc/dout] [get_bd_pins axi_intc_cmc/intr]
connect_bd_net -net axi_gpio_mb_reset_gpio_io_o [get_bd_pins axi_gpio_cmc_mb_rst_n/gpio_io_o] [get_bd_pins reset_gen/axi_gpio_rst_n]
connect_bd_net [get_bd_pins axi_gpio_mutex_cmc/gpio2_io_o] [get_bd_pins axi_gpio_mutex_host/gpio2_io_i]
connect_bd_net [get_bd_pins axi_gpio_mutex_host/gpio_io_o] [get_bd_pins axi_gpio_mutex_cmc/gpio_io_i]
connect_bd_net -net interrupt_wdt_cmc_net [get_bd_pins axi_timebase_wdt/wdt_reset] \
  [get_bd_pins concat_host_interrupts/In0] [get_bd_pins reset_gen/wdt_reset]
connect_bd_net -net c_counter_binary_0_Q [get_bd_pins freerun_counter/Q] [get_bd_pins axi_gpio_timebase/gpio_io_i]
connect_bd_net -net cmc_mb_rst [get_bd_pins psreset_cmc/mb_reset] [get_bd_pins axi_intc_cmc/processor_rst] [get_bd_pins microblaze_cmc/Reset]
connect_bd_net -net concat_hbm_temp_net [get_bd_pins concat_hbm_temp/dout] [get_bd_pins axi_gpio_hbm_temp/gpio_io_i]
connect_bd_net -net gnd_hbm_net [get_bd_pins gnd_bus_1_hbm/dout] [get_bd_pins concat_hbm_temp/In1]
connect_bd_net -net hbm_temp_1_net [get_bd_ports hbm_temp_1] [get_bd_pins concat_hbm_temp/In0]
connect_bd_net -net hbm_temp_2_net [get_bd_ports hbm_temp_2] [get_bd_pins concat_hbm_temp/In2]
connect_bd_net -net interrupt_gpio_net [get_bd_pins axi_gpio_mb_intr/gpio_io_o] [get_bd_pins concat_host_interrupts/In1]
connect_bd_net -net interrupt_host [get_bd_pins axi_intc_host/irq] [get_bd_ports interrupt_host]
connect_bd_net [get_bd_ports mdm_debug_sys_rst] [get_bd_pins psreset_cmc/mb_debug_sys_rst]
connect_bd_net -net rst_1 [get_bd_pins psreset_cmc/bus_struct_reset] [get_bd_pins microblaze_local_memory/rst]
connect_bd_net -net wdt_freeze [get_bd_pins axi_gpio_wdt/gpio_io_o] [get_bd_pins axi_timebase_wdt/freeze]
connect_bd_net [get_bd_pins concat_host_interrupts/dout] [get_bd_pins axi_intc_host/intr]
connect_bd_net [get_bd_pins reset_gen/resetn] [get_bd_pins psreset_cmc/aux_reset_in]
connect_bd_net [get_bd_ports qsfp0_int_l] [get_bd_pins qsfp_gpio_hierarchy/qsfp0_int_l]
connect_bd_net -net qsfp0_lpmode [get_bd_pins qsfp_gpio_hierarchy/qsfp0_lpmode] [get_bd_ports qsfp0_lpmode]
connect_bd_net [get_bd_ports qsfp0_modprs_l] [get_bd_pins qsfp_gpio_hierarchy/qsfp0_modprs_l]
connect_bd_net -net qsfp0_modsel_l [get_bd_pins qsfp_gpio_hierarchy/qsfp0_modsel_l] [get_bd_ports qsfp0_modsel_l]
connect_bd_net -net qsfp0_reset_l [get_bd_pins qsfp_gpio_hierarchy/qsfp0_reset_l] [get_bd_ports qsfp0_reset_l]
connect_bd_net [get_bd_ports qsfp1_int_l] [get_bd_pins qsfp_gpio_hierarchy/qsfp1_int_l]
connect_bd_net -net qsfp1_lpmode [get_bd_pins qsfp_gpio_hierarchy/qsfp1_lpmode] [get_bd_ports qsfp1_lpmode]
connect_bd_net [get_bd_ports qsfp1_modprs_l] [get_bd_pins qsfp_gpio_hierarchy/qsfp1_modprs_l]
connect_bd_net -net qsfp1_modsel_l [get_bd_pins qsfp_gpio_hierarchy/qsfp1_modsel_l] [get_bd_ports qsfp1_modsel_l]
connect_bd_net -net qsfp1_reset_l [get_bd_pins qsfp_gpio_hierarchy/qsfp1_reset_l] [get_bd_ports qsfp1_reset_l]
set_property HDL_ATTRIBUTE.BMM_INFO_PROCESSOR {microblaze-le > bd_43c9 microblaze_local_memory/lmb_bram_if_cntlr bd_43c9 axi_bram_ctrl_regmap_cmc} [get_bd_cells microblaze_cmc]
set_property HDL_ATTRIBUTE.KEEP_HIERARCHY yes [get_bd_cells microblaze_cmc]
set_property HDL_ATTRIBUTE.BMM_INFO_ADDRESS_SPACE {byte  0x01FA0000 32 > bd_43c9 reg_map_bram} [get_bd_cells axi_bram_ctrl_regmap_cmc]
set_property HDL_ATTRIBUTE.KEEP_HIERARCHY yes [get_bd_cells axi_bram_ctrl_regmap_cmc]

# ---- address map ----
assign_bd_address -offset 0x01F00000 -range 64K -target_address_space [get_bd_addr_spaces microblaze_cmc/Data] [get_bd_addr_segs build_info_cmc/S_AXI/reg0]
assign_bd_address -offset 0x01F10000 -range 64K -target_address_space [get_bd_addr_spaces microblaze_cmc/Data] [get_bd_addr_segs qsfp_gpio_hierarchy/axi_gpio_qsfp/S_AXI/Reg]
assign_bd_address -offset 0x01F20000 -range 64K -target_address_space [get_bd_addr_spaces microblaze_cmc/Data] [get_bd_addr_segs axi_gpio_hbm_temp/S_AXI/Reg]
assign_bd_address -offset 0x01F30000 -range 64K -target_address_space [get_bd_addr_spaces microblaze_cmc/Data] [get_bd_addr_segs axi_gpio_mb_intr/S_AXI/Reg]
assign_bd_address -offset 0x01F40000 -range 64K -target_address_space [get_bd_addr_spaces microblaze_cmc/Data] [get_bd_addr_segs axi_gpio_wdt/S_AXI/Reg]
assign_bd_address -offset 0x01F50000 -range 64K -target_address_space [get_bd_addr_spaces microblaze_cmc/Data] [get_bd_addr_segs axi_intc_cmc/S_AXI/Reg]
assign_bd_address -offset 0x01F60000 -range 64K -target_address_space [get_bd_addr_spaces microblaze_cmc/Data] [get_bd_addr_segs axi_timebase_wdt/S_AXI/Reg]
assign_bd_address -offset 0x01F70000 -range 64K -target_address_space [get_bd_addr_spaces microblaze_cmc/Data] [get_bd_addr_segs axi_uartlite_satellite/S_AXI/Reg]
assign_bd_address -offset 0x01F80000 -range 64K -target_address_space [get_bd_addr_spaces microblaze_cmc/Data] [get_bd_addr_segs axi_uartlite_usb/S_AXI/Reg]
assign_bd_address -offset 0x01F90000 -range 64K -target_address_space [get_bd_addr_spaces microblaze_cmc/Data] [get_bd_addr_segs axi_gpio_timebase/S_AXI/Reg]
assign_bd_address -offset 0x01FA0000 -range 8K -target_address_space [get_bd_addr_spaces microblaze_cmc/Data] [get_bd_addr_segs axi_bram_ctrl_regmap_cmc/S_AXI/Mem0]
assign_bd_address -offset 0x01FB0000 -range 64K -target_address_space [get_bd_addr_spaces microblaze_cmc/Data] [get_bd_addr_segs axi_gpio_mutex_cmc/S_AXI/Reg]
assign_bd_address -offset 0xF0000000 -range 128K -target_address_space [get_bd_addr_spaces microblaze_cmc/Data] [get_bd_addr_segs microblaze_local_memory/lmb_bram_if_cntlr/SLMB/Mem]
assign_bd_address -offset 0xF0000000 -range 128K -target_address_space [get_bd_addr_spaces microblaze_cmc/Instruction] [get_bd_addr_segs microblaze_local_memory/lmb_bram_if_cntlr/SLMB1/Mem]
assign_bd_address -offset 0x00000 -range 128K -target_address_space [get_bd_addr_spaces s_axi_ctrl_mgmt] [get_bd_addr_segs axi_bram_ctrl_firmware/S_AXI/Mem0]
assign_bd_address -offset 0x20000 -range 4K -target_address_space [get_bd_addr_spaces s_axi_ctrl_mgmt] [get_bd_addr_segs axi_gpio_cmc_mb_rst_n/S_AXI/Reg]
assign_bd_address -offset 0x21000 -range 4K -target_address_space [get_bd_addr_spaces s_axi_ctrl_mgmt] [get_bd_addr_segs axi_gpio_mutex_host/S_AXI/Reg]
assign_bd_address -offset 0x22000 -range 4K -target_address_space [get_bd_addr_spaces s_axi_ctrl_mgmt] [get_bd_addr_segs axi_intc_host/S_AXI/Reg]
assign_bd_address -offset 0x28000 -range 8K -target_address_space [get_bd_addr_spaces s_axi_ctrl_mgmt] [get_bd_addr_segs axi_bram_ctrl_regmap_host/S_AXI/Mem0]
assign_bd_address -offset 0x2A000 -range 4K -target_address_space [get_bd_addr_spaces s_axi_ctrl_mgmt] [get_bd_addr_segs build_info_host/S_AXI/reg0]

validate_bd_design
save_bd_design
